# Altium schematic sheet TitleBlock.SchDoc: =ProjectTitle
size B; Engineer: H. Collector; Organization: IMR Engineering; Address1: 3621 Gin Way; Address2: Snellville, GA 30039; Address3: USA; SheetNumber: 1; SheetTotal: 10; Rule: UNIONINDEX=0|RULEKIND=MatchedLengths|NETSCOPE=DifferentNets|LAYERKIND=SameLayer|NAME=Schematic Matched Net Lengths|TOLERANCE=100mil|CHECKNETSINDIFFPAIR=FALSE|CHECKDIFFPAIRVSDIFFPAIR=TRUE|CHECKXSIGNALS=TRUE|CHECKOTHERS=TRUE|UNIT=Metric
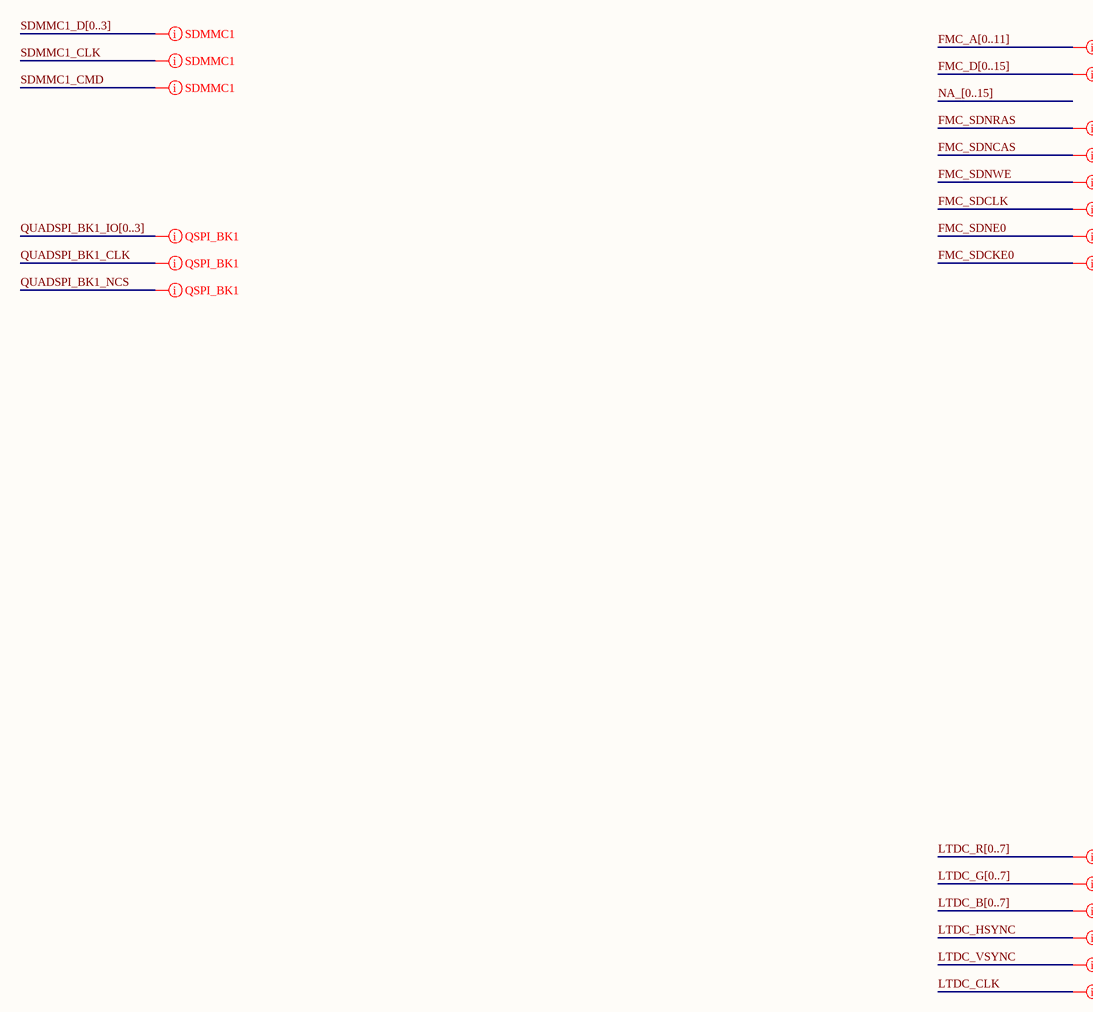
[diagram p0: TitleBlock.SchDoc]

## Buses and harness runs
bus FMC_A[0..11]
bus FMC_D[0..15]
bus LTDC_B[0..7]
bus LTDC_G[0..7]
bus LTDC_R[0..7]
bus NA_[0..15]
bus QUADSPI_BK1_IO[0..3]
bus SDMMC1_D[0..3]

## Layout directives
mark named TFT_LCD: (no net found under the mark), LTDC_CLK, LTDC_HSYNC, LTDC_VSYNC
rule Matched Net Lengths [Tolerance = 28mm]: (no net found under the mark)
rule Matched Net Lengths [Tolerance = 38mm]: (no net found under the mark), QUADSPI_BK1_CLK, QUADSPI_BK1_NCS, SDMMC1_CLK, SDMMC1_CMD
rule Matched Net Lengths [Tolerance = 28mm]; net class FMC_CTL: FMC_SDCKE0, FMC_SDCLK, FMC_SDNCAS, FMC_SDNE0, FMC_SDNRAS, FMC_SDNWE

## Notes on the sheet
- Title
- Size:
- Date:
- B
- Number:
- Engr:
- Revision:
- Sheet
- of
- File: